# EAGLE design Puzzle Infrared_Receiver_v0.9 (EAGLE 6.2)
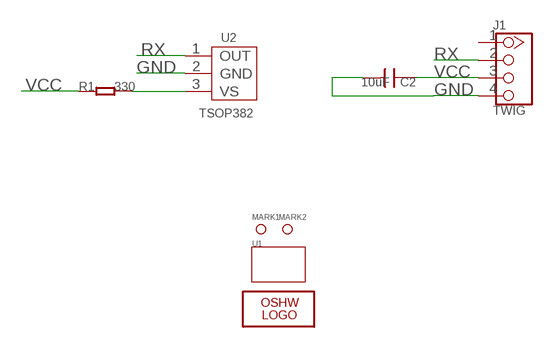
[diagram p0: schematic, sheet 1]

## Parts
C2  10uF  C-0805  [0805]
J1  TWIG  TWIG-2.0-LEADED-2.0  [4P-LEADED-2.0]
LOGO1  LOGO-OSHW-FILLX0150-NT  [OSHW_FILLX150_NOTEXT]
MARK1  PAD-MARK  [ROUND-MARK-0.635]
MARK2  PAD-MARK  [ROUND-MARK-0.635]
R1  330  R-0603  [0603]
U1  TWIG-1U  [1U-DIM-W/-DRILL]
U2  TSOP382  [3P-2.54-4.8X5X6.95H]

## Nets
GND: J1.4 U2.2(GND)
N$1: R1.2 U2.3(VS)
N$2: C2.2
RX: J1.2 U2.1(OUT)
VCC: C2.1 J1.3 R1.1
Unconnected: J1.1

## Library data of the parts
C2 = Discrete:C*: Ceramic Capacitors
J1 = Connector:TWIG-2.0-LEADED
LOGO1 = Logo:LOGO-OSHW-FILL
MARK1 MARK2 = Discrete:PAD-MARK
R1 = Discrete:R*
U1 = Module:TWIG
U2 = IC:TSOP382: IR Receiver Modules for Remote Control Systems

## Board
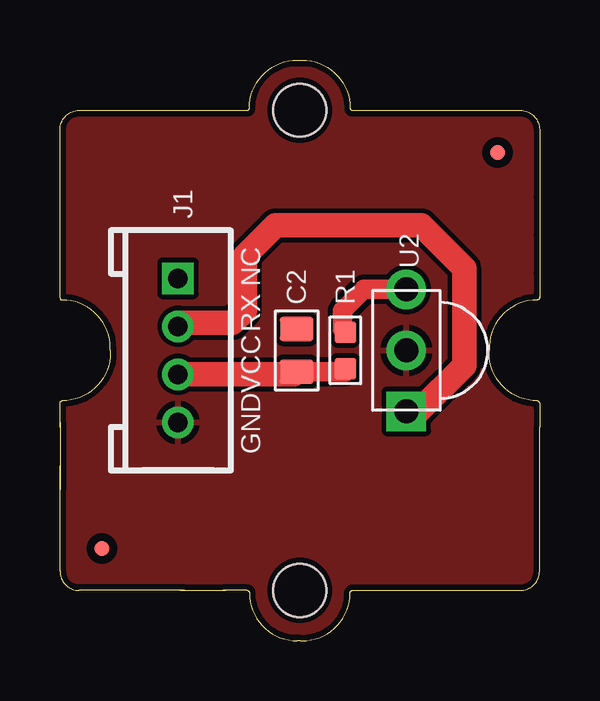
[diagram p1: board, top side]
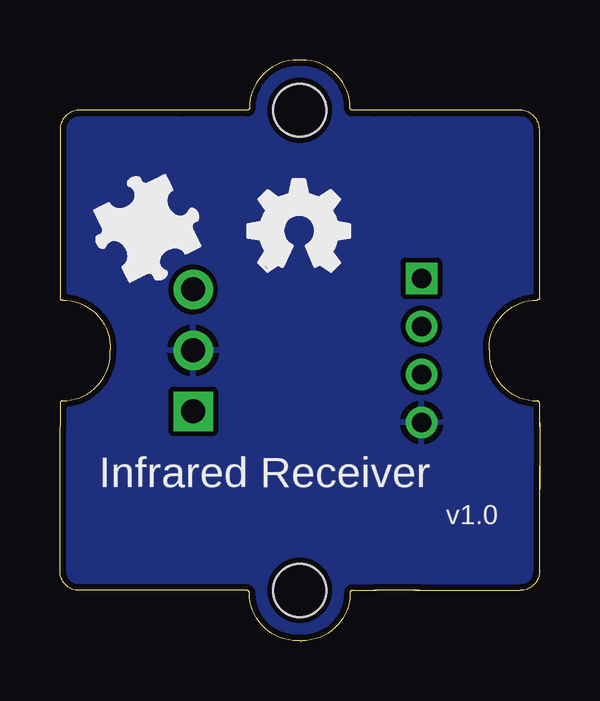
[diagram p2: board, bottom side, seen from below]

Size 20 x 24.2 mm. Coordinates in mm from the lower left corner, seen from the top.
Copper layers (1*16): Top 0.035mm / dielectric 1.5mm / Bottom 0.035mm
Design rules: minimum track width 10mil, minimum drill 10mil, track to track 8mil, track to pad 8mil, pad to pad 8mil, via to via 8mil, smd to smd 8mil, copper to edge 10mil, drill to drill 10mil, minimum pad ring 10mil, minimum via ring 8mil, stop-mask expansion 4mil, vias tented up to drill 0mil, thermal gap 10mil

### Footprints (pad centres in the part's own frame; a part is rotated, then mirrored left to right if it is on the bottom)
0805 = smd 1.016 x 1.397: 1 -0.889,0; 2 0.889,0
4P-LEADED-2.0 = drill 0.8 pad 1.27 square: 1 -3,0 | drill 0.8 pad 1.27: 2 -1,0; 3 1,0; 4 3,0
ROUND-MARK-0.635 = smd 0.635 x 0.635: P$1 0,0
0603 = smd 0.889 x 0.889: 1 -0.762,0; 2 0.762,0
1U-DIM-W/-DRILL = hole 2.2: 0,-10; 0,10
3P-2.54-4.8X5X6.95H = drill 1 pad 1.65 square: 1 -2.54,0 | drill 1 pad 1.65: 2 0,0; 3 2.54,0

### Placement (x,y rotation side)
C2  9.87,12.1 90 top
J1  4.92,12.1 270 top
LOGO1  12.16,15.4 0 bottom
MARK1  1.74,3.84 0 top
MARK2  18.25,20.36 0 top
R1  11.91,12.1 90 top
U1  10,12.1 0 top
U2  14.44,12.1 90 top
U$2  [BRICK-LOGO-MIL-0.5]  18.89,14.64 0 bottom

### Tracks (layer width: path | path; a pad name or v marks a point on that pad's centre or on a via)
GND
  pour Top: -1.18,-0.47 21.68,-0.47 21.68,23.91 -1.18,23.91
  pour Bottom: -1.18,-0.73 21.94,-0.73 21.94,24.17 -1.18,24.17
N$1
  Top 0.813: U2.3 12.67,14.64 11.78,13.75 11.78,12.99 R1.2
RX
  Top 1.016: U2.1 14.95,9.56 16.86,11.47 16.86,15.53 15.08,17.31 8.98,17.31 7.71,16.04 7.71,13.75 7.21,13.24 5.06,13.24 J1.2
VCC
  Top 0.813: C2.1 11.91,11.21 R1.1
  Top 1.016: J1.3 9.76,11.1 C2.1

### Text on the board
tPlace: NC | RX | VCC | GND
bPlace: Infrared Receiver | v1.0